# EAGLE schematic RS485_Mayfly (EAGLE 9.1.3)
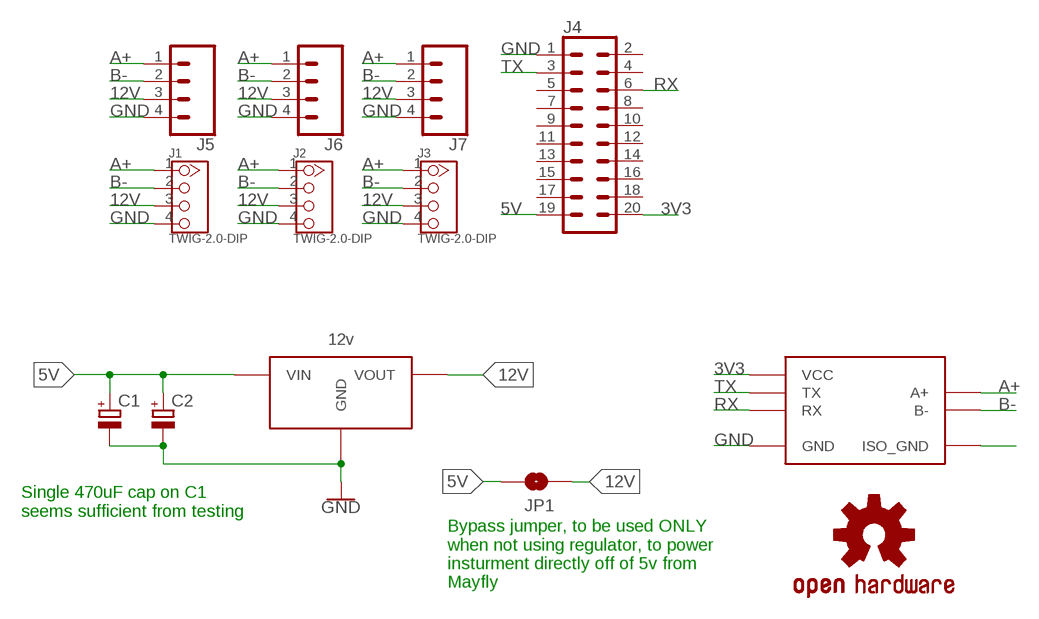
[diagram p0: schematic, sheet 1]

## Parts
C1  CPOL-EUE2,5-6E  [E2,5-6E]
C2  CPOL-EUE2,5-6E  [E2,5-6E]
J1  TWIG-2.0-DIP  [2.0_1X4]
J2  TWIG-2.0-DIP  [2.0_1X4]
J3  TWIG-2.0-DIP  [2.0_1X4]
J4  CONN_10X2MALE  [2X10]
J5  CONN_42.54_NOSILK  [1X04_NOSILK]
J6  CONN_42.54_NOSILK  [1X04_NOSILK]
J7  CONN_42.54_NOSILK  [1X04_NOSILK]
JP1  JUMPER-SMT_2_NO_SILK  [SMT-JUMPER_2_NO_SILK]
LOGO1  OSHW-LOGOMINI  [OSHW-LOGO-MINI]
U$1  12v  POLOLU_VREG  [POLOLU_REG]
U$2  SMC_RS485  [SMC_RS485]

## Nets
3V3: J4.20 U$2.VCC
5V: C1.+ C2.+ J4.19 JP1.2 U$1.VIN
12V: J1.3 J2.3 J3.3 J5.3 J6.3 J7.3 JP1.1 U$1.VOUT
A+: J1.1 J2.1 J3.1 J5.1 J6.1 J7.1 U$2.A+
B-: J1.2 J2.2 J3.2 J5.2 J6.2 J7.2 U$2.B-
GND: C1.- C2.- J1.4 J2.4 J3.4 J4.1 J5.4 J6.4 J7.4 U$1.GND U$2.GND
N$12: U$2.GND_ISO(ISO_GND)
RX: J4.6 U$2.RX
TX: J4.3 U$2.TX
Unconnected: J4.2 J4.4 J4.5 J4.7 J4.8 J4.9 J4.10 J4.11 J4.12 J4.13 J4.14 J4.15 J4.16 J4.17 J4.18

## Notes on the sheet
- Single 470uF cap on C1 
  seems sufficient from testing
- Bypass jumper, to be used ONLY
  when not using regulator, to power
  insturment directly off of 5v from
  Mayfly

## Library data of the parts
C1 C2 = bschulz_passives:CPOL-EU: POLARIZED CAPACITOR, European symbol; SPICEPREFIX: C
J1-J3 = Limnotech:TWIG-2.0-DIP
J4 = bschulz:CONN_10X2: Multi connection point. Often used as Generic Header-pin footprint for 0.1 inch spaced/style header connections On any of the 0.1 inch spaced packages, you can populate with these: Break Away Headers - Straight <https://www.sparkfun.com/products/116> (PRT-00116) Break Away Male Headers - Right Angle <https://www.sparkfun.com/products/553> (PRT-00553) Female Headers <https://www.sparkfun.com/products/115> (PRT-00115) Break Away Headers - Machine Pin <https://www.sparkfun.com/products/117> (PRT-00117) Break Away Female Headers - Swiss Machine Pin <https://www.sparkfun.com/products/743> (PRT-00743) Special note about the "SPECIAL" package: This was SPECIALLY designed to be used with our Graphic LCD Backpack. Be sure you want to use this! It is not only staggered on each line of header holes, but IT IS ALSO offset of the center point of the top and bottom lines by 5 mil. This causes the headers to lock into place on the "standard" footprint on the LCD screen. The extra squares on the tdocu layer are there simply to reference other pins (if you were to actually populate a longer header than ten long - this is what we do with the backpacks).; DIGIKEY: S2011EC-10-ND; MF: Sullins; MPN: PRPC010DAAN-RC
J5-J7 = bschulz:CONN_4: Genaric 4 pin connector
JP1 = SparkFun-Jumpers:JUMPER-SMT_2_NO: Normally open jumper This jumper has two pads in close proximity to each other. Apply solder to close the connection. Round pads are easier to solder for beginners, but are a lot larger. SparkFun Product that uses the round pads: SparkFun EL Sequencer <https://www.sparkfun.com/products/12781>
LOGO1 = SparkFun-Aesthetics:OSHW-LOGO: Open-Source Hardware (OSHW) Logo This logo indicates the piece of hardware it is found on incorporates a OSHW license and/or adheres to the definition of open source hardware found here: http://freedomdefined.org/OSHW
U$1 = Limnotech:POLOLU_VREG: Designed for connecting Pololu switch-mode voltage regulator modules For use with: U3V12F12 (12v), U3V12F9 (9v), U312F5 (5v) Make certian pinout matches before use, as come Pololu regulators have a different Vin, Vout placment!
U$2 = Limnotech:SMC_RS485: Layout for connecting SMC RS-485 module Module <https://www.amazon.com/SMAKN%C2%AE-Adapter-Serial-Converter-Module/dp/B010723BCE>